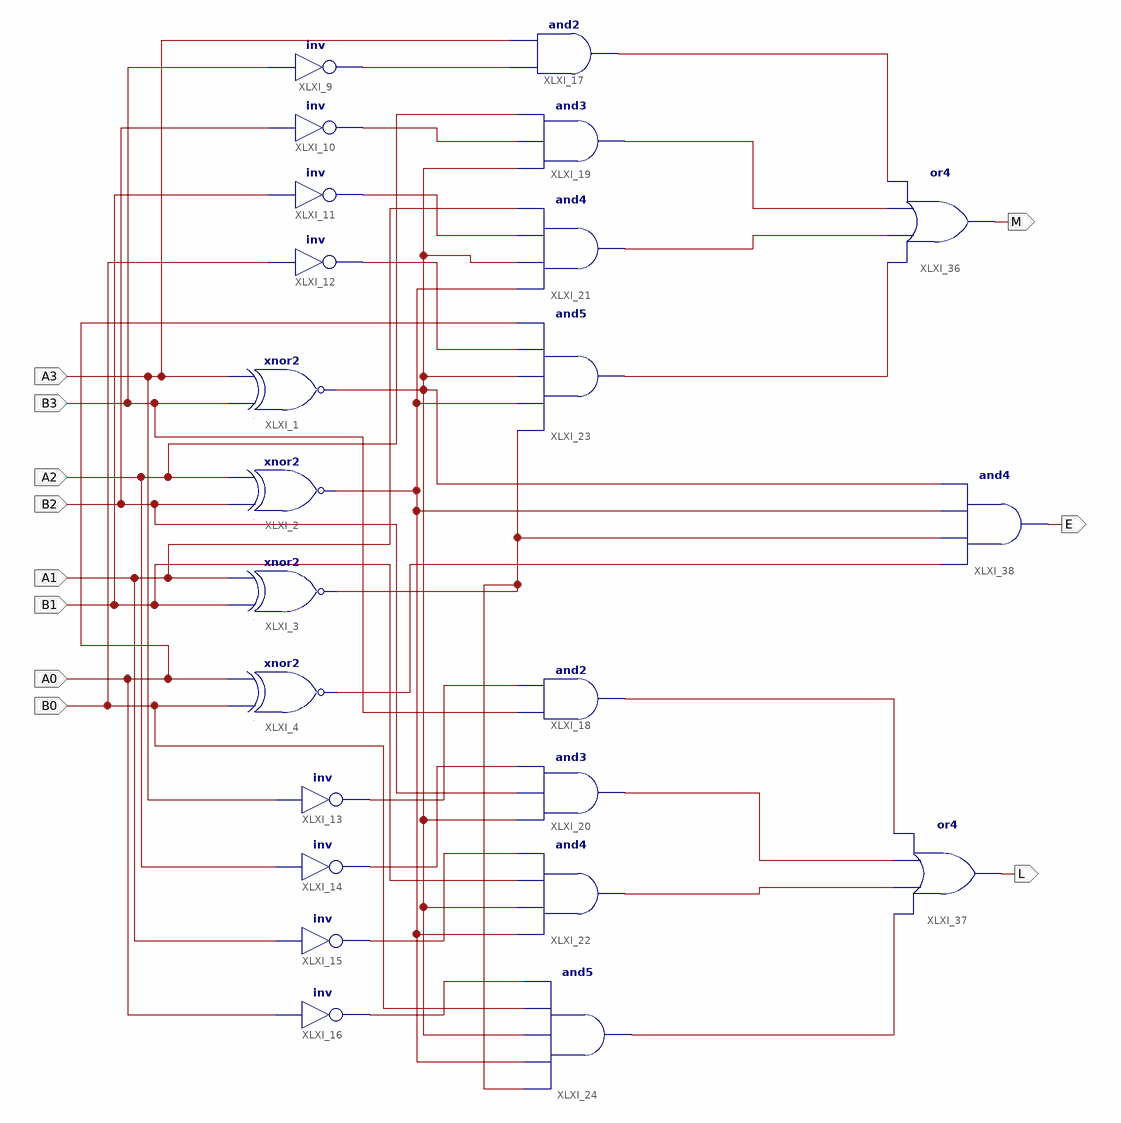
[diagram p0: schematic sheet 1]
// Xilinx ISE schematic COMP4bitsm_l_e.sch (spartan6) as structural Verilog: 23 symbols, 11 ports
module COMP4bitsm_l_e (
  input  A3,
  input  A2,
  input  A1,
  input  A0,
  input  B0,
  input  B1,
  input  B2,
  input  B3,
  output M,
  output E,
  output L
);

  wire XLXN_27, XLXN_28, XLXN_29, XLXN_30, XLXN_31, XLXN_32, XLXN_33, XLXN_34, XLXN_35, XLXN_39, XLXN_42,
       XLXN_43, XLXN_44, XLXN_45, XLXN_46, XLXN_47, XLXN_48, XLXN_49, XLXN_50, XLXN_51;

  xnor XLXI_1 (XLXN_35, B3, A3);
  xnor XLXI_2 (XLXN_39, B2, A2);
  xnor XLXI_3 (XLXN_42, B1, A1);
  xnor XLXI_4 (XLXN_51, B0, A0);
  not XLXI_9 (XLXN_27, B3);
  not XLXI_10 (XLXN_28, B2);
  not XLXI_11 (XLXN_29, B1);
  not XLXI_12 (XLXN_30, B0);
  not XLXI_13 (XLXN_31, A3);
  not XLXI_14 (XLXN_32, A2);
  not XLXI_15 (XLXN_33, A1);
  not XLXI_16 (XLXN_34, A0);
  and XLXI_17 (XLXN_43, XLXN_27, A3);
  and XLXI_19 (XLXN_44, XLXN_35, XLXN_28, A2);
  and XLXI_21 (XLXN_45, XLXN_39, XLXN_35, XLXN_29, A1);
  and XLXI_23 (XLXN_46, XLXN_42, XLXN_39, XLXN_35, XLXN_30, A0);
  and XLXI_18 (XLXN_47, B3, XLXN_31);
  and XLXI_24 (XLXN_50, XLXN_42, XLXN_39, XLXN_35, B0, XLXN_34);
  and XLXI_22 (XLXN_49, XLXN_39, XLXN_35, B1, XLXN_33);
  and XLXI_20 (XLXN_48, XLXN_35, B2, XLXN_32);
  or XLXI_36 (M, XLXN_46, XLXN_45, XLXN_44, XLXN_43);
  or XLXI_37 (L, XLXN_50, XLXN_49, XLXN_48, XLXN_47);
  and XLXI_38 (E, XLXN_51, XLXN_42, XLXN_39, XLXN_35);
endmodule
